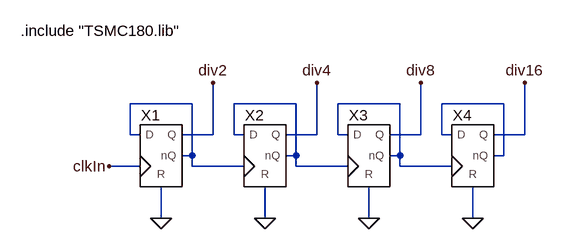
[diagram p0: schematic freq_divider_power_2.asc]
freq_divider_power_2.asc, the LTspice schematic file:
Version 4
SHEET 1 2200 680
WIRE 1056 208 960 208
WIRE 1216 208 1120 208
WIRE 1376 208 1280 208
WIRE 1536 208 1440 208
WIRE 960 256 960 208
WIRE 976 256 960 256
WIRE 1088 256 1088 176
WIRE 1088 256 1040 256
WIRE 1120 256 1120 208
WIRE 1136 256 1120 256
WIRE 1248 256 1248 176
WIRE 1248 256 1200 256
WIRE 1280 256 1280 208
WIRE 1296 256 1280 256
WIRE 1408 256 1408 176
WIRE 1408 256 1360 256
WIRE 1440 256 1440 208
WIRE 1456 256 1440 256
WIRE 1568 256 1568 176
WIRE 1568 256 1520 256
WIRE 1056 288 1056 208
WIRE 1056 288 1040 288
WIRE 1216 288 1216 208
WIRE 1216 288 1200 288
WIRE 1376 288 1376 208
WIRE 1376 288 1360 288
WIRE 1536 288 1536 208
WIRE 1536 288 1520 288
WIRE 976 304 928 304
WIRE 1056 304 1056 288
WIRE 1136 304 1056 304
WIRE 1216 304 1216 288
WIRE 1296 304 1216 304
WIRE 1376 304 1376 288
WIRE 1456 304 1376 304
WIRE 1008 384 1008 336
WIRE 1168 384 1168 336
WIRE 1328 384 1328 336
WIRE 1488 384 1488 336
FLAG 928 304 clkIn
FLAG 1008 384 0
FLAG 1168 384 0
FLAG 1328 384 0
FLAG 1488 384 0
FLAG 1088 176 div2
FLAG 1248 176 div4
FLAG 1408 176 div8
FLAG 1568 176 div16
SYMBOL ffd_arst 1008 288 R0
SYMATTR InstName X1
SYMATTR SpiceLine VDD={VDD} L={L} LD={LD} WN={WN} WPFACT=1.5
SYMBOL ffd_arst 1168 288 R0
SYMATTR InstName X2
SYMATTR SpiceLine VDD={VDD} L={L} LD={LD} WN={WN} WPFACT=1.5
SYMBOL ffd_arst 1328 288 R0
SYMATTR InstName X3
SYMATTR SpiceLine VDD={VDD} L={L} LD={LD} WN={WN} WPFACT=1.5
SYMBOL ffd_arst 1488 288 R0
SYMATTR InstName X4
SYMATTR SpiceLine VDD={VDD} L={L} LD={LD} WN={WN} WPFACT=1.5
TEXT 792 96 Left 2 !.include "TSMC180.lib"

The netlist it stands for:
* freq_divider_power_2.asc
XX1 N001 div2 clkIn 0 N001 ffd_arst VDD={VDD} L={L} LD={LD} WN={WN} WPFACT=1.5  ; pins D Q CLK R nQ
XX2 N002 div4 N001 0 N002 ffd_arst VDD={VDD} L={L} LD={LD} WN={WN} WPFACT=1.5  ; pins D Q CLK R nQ
XX3 N003 div8 N002 0 N003 ffd_arst VDD={VDD} L={L} LD={LD} WN={WN} WPFACT=1.5  ; pins D Q CLK R nQ
XX4 N004 div16 N003 0 N004 ffd_arst VDD={VDD} L={L} LD={LD} WN={WN} WPFACT=1.5  ; pins D Q CLK R nQ
.include "TSMC180.lib"
.backanno
.end